# Altium schematic sheet breakout_arduino.SchDoc
size B
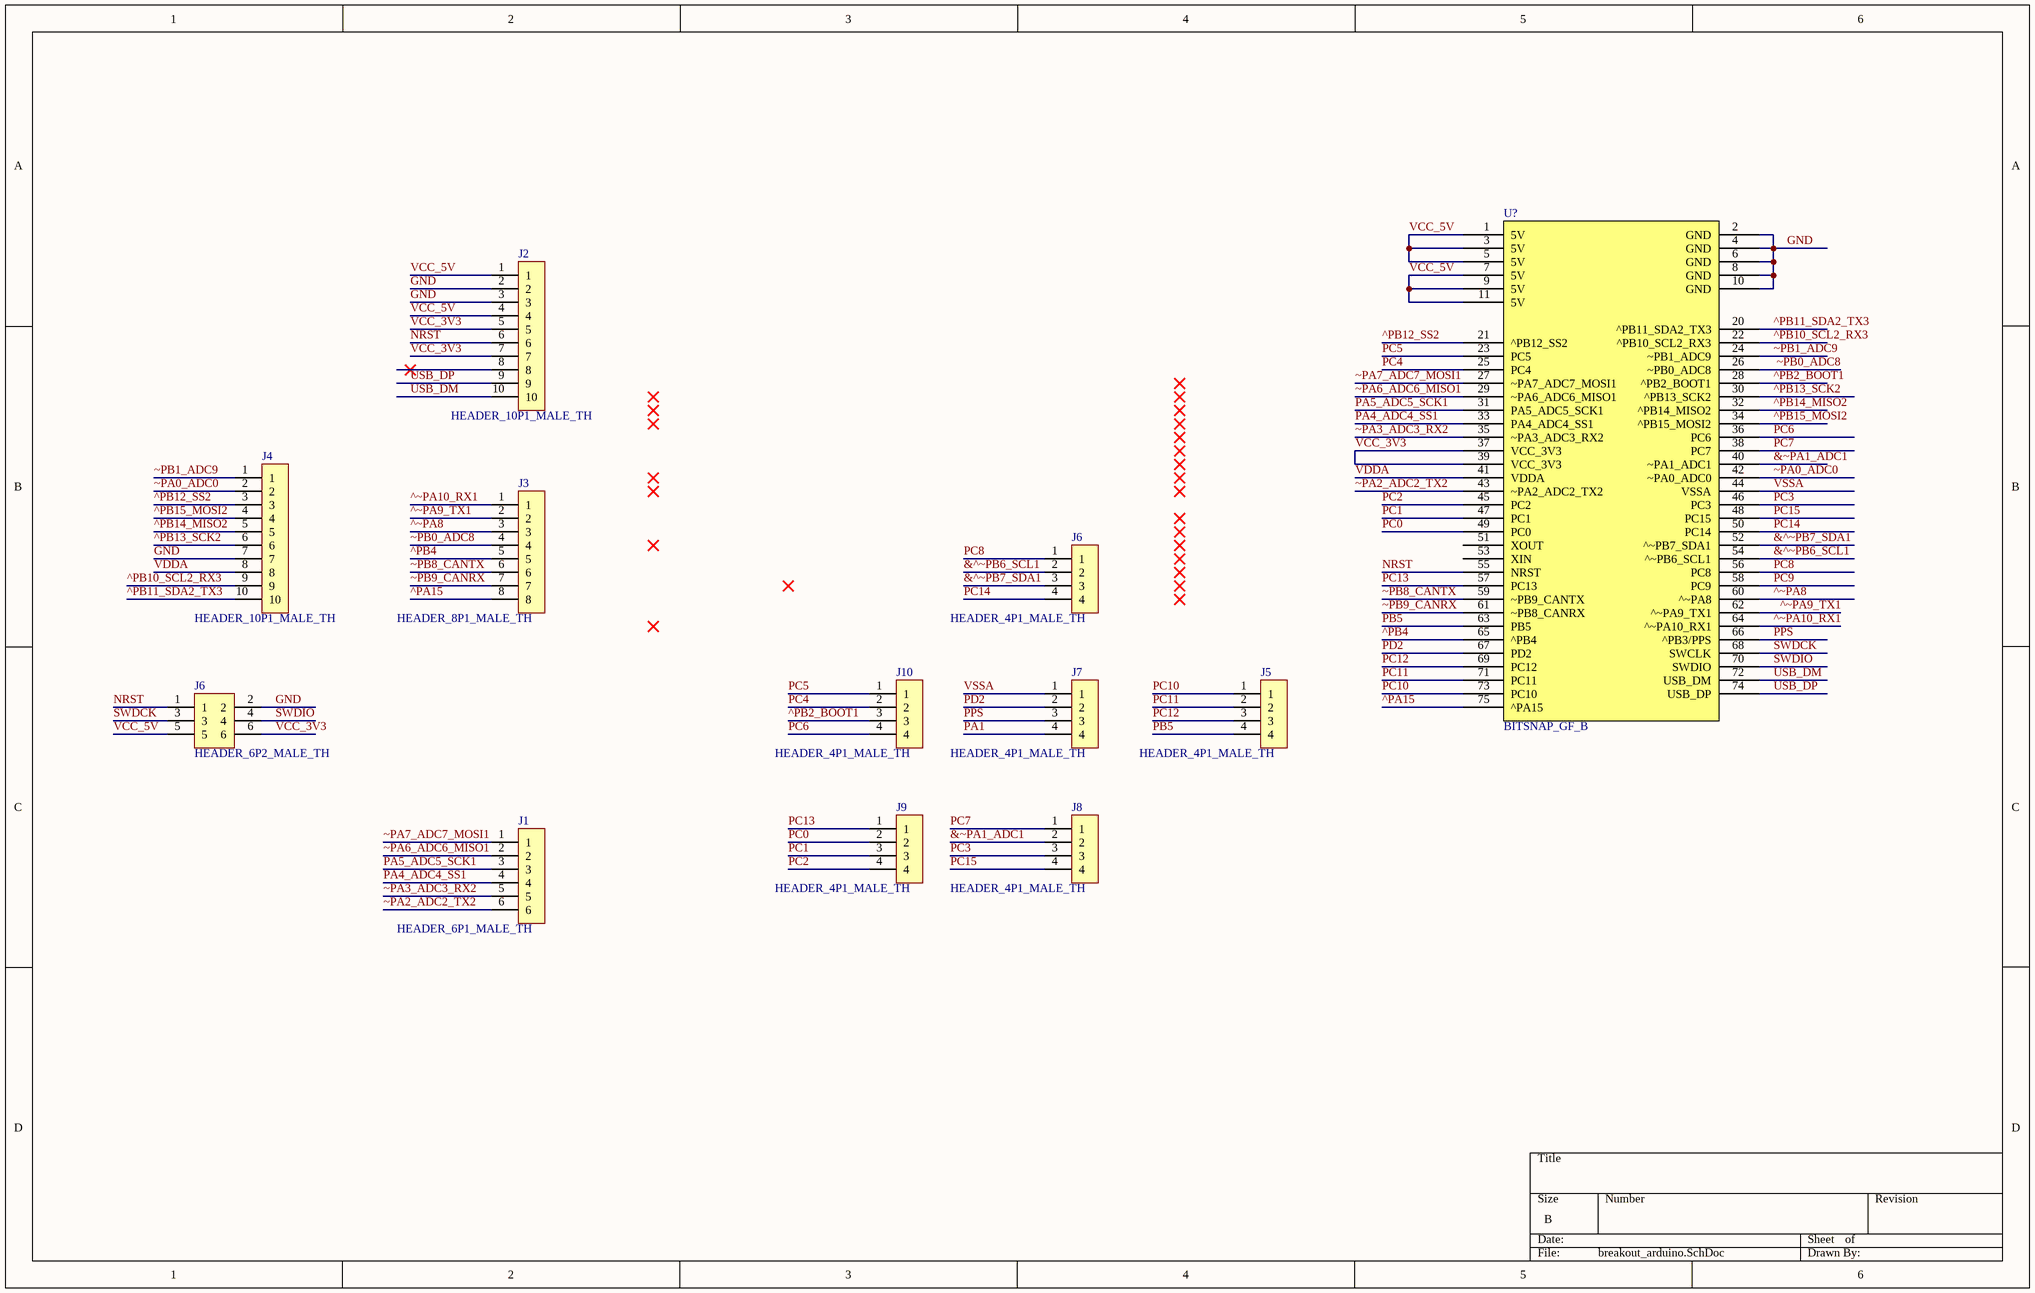
[diagram p0: breakout_arduino.SchDoc]

## Parts
(Parts that share a designator on the sheet are numbered #1, #2 ... from top to bottom, then left to right.)
J1  HEADER_6P1_MALE_TH  [HEADER_6P1_MALE_TH]
J2  HEADER_10P1_MALE_TH  [HEADER_10P1_MALE_TH]
J3  HEADER_8P1_MALE_TH  [HEADER_8P1_MALE_TH]
J4  HEADER_10P1_MALE_TH  [HEADER_10P1_MALE_TH]
J5  HEADER_4P1_MALE_TH  [HEADER_4P1_MALE_TH]
J6#1  HEADER_4P1_MALE_TH  [HEADER_4P1_MALE_TH]
J6#2  HEADER_6P2_MALE_TH  [HEADER_6P2_MALE_TH]
J7  HEADER_4P1_MALE_TH  [HEADER_4P1_MALE_TH]
J8  HEADER_4P1_MALE_TH  [HEADER_4P1_MALE_TH]
J9  HEADER_4P1_MALE_TH  [HEADER_4P1_MALE_TH]
J10  HEADER_4P1_MALE_TH  [HEADER_4P1_MALE_TH]
U?  BITSNAP_GF_B  [BITSNAP_CPU_NGFF_B]

## Nets
&^~PB6_SCL1: J6#1.2 U?.54(^~PB6_SCL1)
&^~PB7_SDA1: J6#1.3 U?.52(^~PB7_SDA1)
&~PA1_ADC1: J8.2 U?.40(~PA1_ADC1)
^PA15: J3.8 U?.75(^PA15)
^PB2_BOOT1: J10.3 U?.28(^PB2_BOOT1)
^PB4: J3.5 U?.65(^PB4)
^PB10_SCL2_RX3: J4.9 U?.22(^PB10_SCL2_RX3)
^PB11_SDA2_TX3: J4.10 U?.20(^PB11_SDA2_TX3)
^PB12_SS2: J4.3 U?.21(^PB12_SS2)
^PB13_SCK2: J4.6 U?.30(^PB13_SCK2)
^PB14_MISO2: J4.5 U?.32(^PB14_MISO2)
^PB15_MOSI2: J4.4 U?.34(^PB15_MOSI2)
^~PA8: J3.3 U?.60(^~PA8)
^~PA9_TX1: J3.2 U?.62(^~PA9_TX1)
^~PA10_RX1: J3.1 U?.64(^~PA10_RX1)
GND: J2.2 J2.3 J4.7 J6#2.2 U?.2(GND) U?.4(GND) U?.6(GND) U?.8(GND) U?.10(GND)
NRST: J2.6 J6#2.1 U?.55(NRST)
PA1: J7.4
PA4_ADC4_SS1: J1.4 U?.33(PA4_ADC4_SS1)
PA5_ADC5_SCK1: J1.3 U?.31(PA5_ADC5_SCK1)
PB5: J5.4 U?.63(PB5)
PC0: J9.2 U?.49(PC0)
PC1: J9.3 U?.47(PC1)
PC2: J9.4 U?.45(PC2)
PC3: J8.3 U?.46(PC3)
PC4: J10.2 U?.25(PC4)
PC5: J10.1 U?.23(PC5)
PC6: J10.4 U?.36(PC6)
PC7: J8.1 U?.38(PC7)
PC8: J6#1.1 U?.56(PC8)
PC9: U?.58(PC9)
PC10: J5.1 U?.73(PC10)
PC11: J5.2 U?.71(PC11)
PC12: J5.3 U?.69(PC12)
PC13: J9.1 U?.57(PC13)
PC14: J6#1.4 U?.50(PC14)
PC15: J8.4 U?.48(PC15)
PD2: J7.2 U?.67(PD2)
PPS: J7.3 U?.66(^PB3/PPS)
SWDCK: J6#2.3 U?.68(SWCLK)
SWDIO: J6#2.4 U?.70(SWDIO)
USB_DM: J2.10 U?.72(USB_DM)
USB_DP: J2.9 U?.74(USB_DP)
VCC_3V3: J2.5 J2.7 J6#2.6 U?.37(VCC_3V3) U?.39(VCC_3V3)
VCC_5V: J2.1 J2.4 J6#2.5 U?.1(5V) U?.3(5V) U?.5(5V) U?.7(5V) U?.9(5V) U?.11(5V)
VDDA: J4.8 U?.41(VDDA)
VSSA: J7.1 U?.44(VSSA)
~PA0_ADC0: J4.2 U?.42(~PA0_ADC0)
~PA2_ADC2_TX2: J1.6 U?.43(~PA2_ADC2_TX2)
~PA3_ADC3_RX2: J1.5 U?.35(~PA3_ADC3_RX2)
~PA6_ADC6_MISO1: J1.2 U?.29(~PA6_ADC6_MISO1)
~PA7_ADC7_MOSI1: J1.1 U?.27(~PA7_ADC7_MOSI1)
~PB0_ADC8: J3.4 U?.26(~PB0_ADC8)
~PB1_ADC9: J4.1 U?.24(~PB1_ADC9)
~PB8_CANTX: J3.6 U?.59(~PB9_CANTX)
~PB9_CANRX: J3.7 U?.61(~PB8_CANRX)

Not connected (* = marked no-connect by the designer): J2 8*; U? 51(XOUT) 53(XIN)

## Library data of the parts
J1 = HEADER_6P1_MALE_TH: HEADER, 2.54MM, THT, 6PIN 1ROW
J2 J4 = HEADER_10P1_MALE_TH: HEADER, 2.54MM, THT, 10PIN 1ROW
J3 = HEADER_8P1_MALE_TH: HEADER, 2.54MM, THT, 8PIN 1ROW
J5 J6#1 J7-J10 = HEADER_4P1_MALE_TH: HEADER, 2.54MM, THT, 4PIN 1ROW
J6#2 = HEADER_6P2_MALE_TH: HEADER, 2.54MM, THT, 6PIN 1ROW
U? = BITSNAP_GF_B: U - IC - Bitsnap CPU, NGFF B Key; Manufacturer: Foxconn; Manufacturer P/N: AS0BC21-S30BB-7H; LCSC Part #: C2761344